# Altium schematic sheet Components.SchDoc
size 400 x 265 mm; SheetNumber: 2; SheetTotal: 2
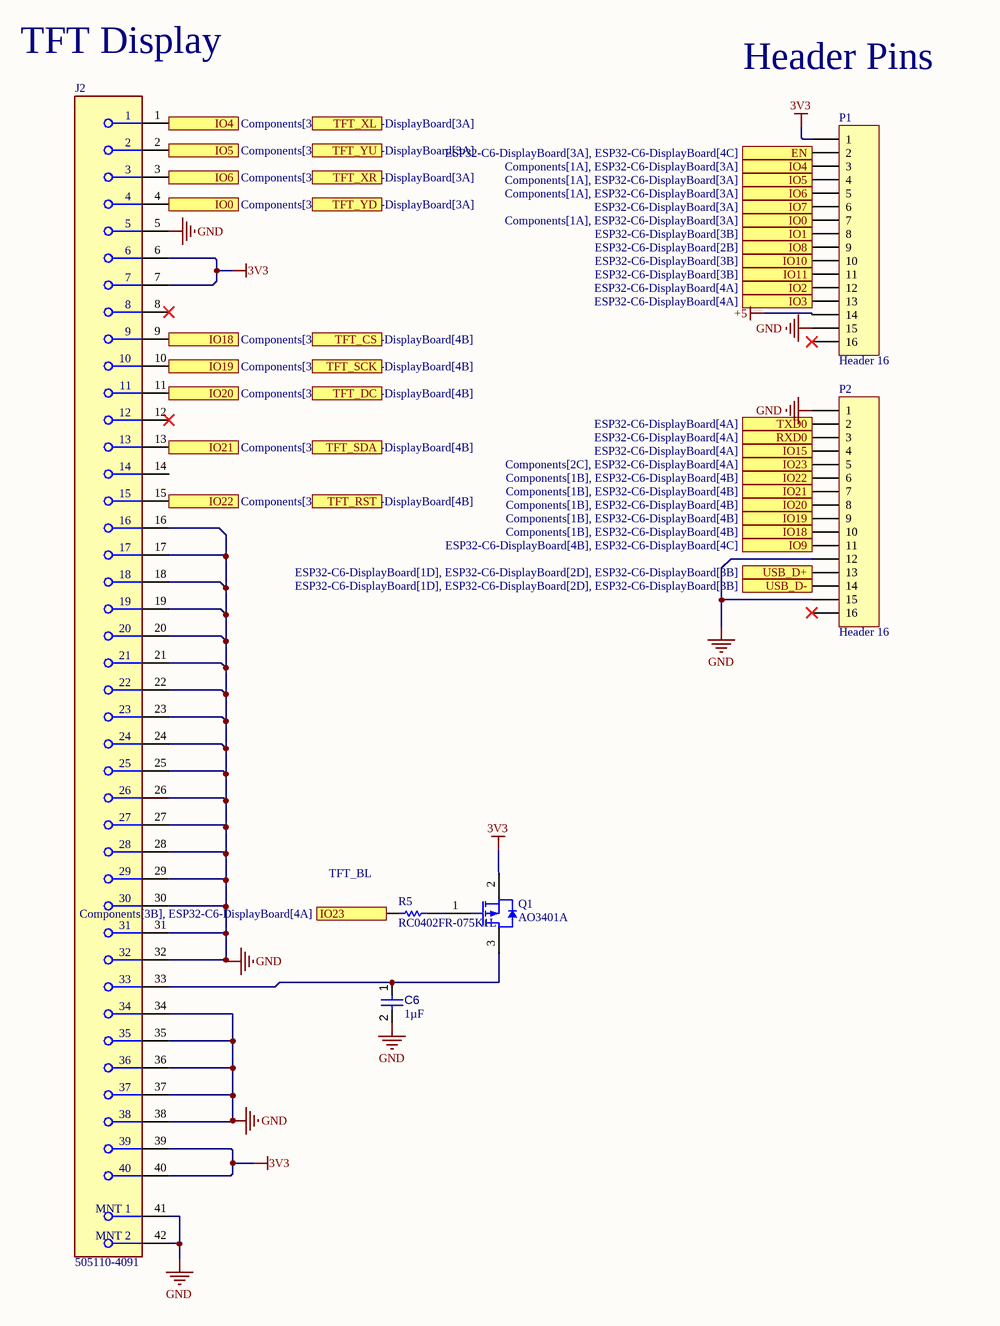
[diagram p0: Components.SchDoc]

## Parts
C6  value 1µF  [CAPC1005X55X25LL05T10]  (hidden comment: Capacitor 1 uF +/- 10% 6.3 V 0402)
J2  505110-4091  [FP-505110-4091-MFG]
P1  Header 16  [HDR1X16]
P2  Header 16  [HDR1X16]
Q1  AO3401A  [AO-SOT-23-3L_V]
R5  RC0402FR-075K1L  [RESC1005X40X25NL05T10]

## Ports
EN (see ESP32-C6-DisplayBoard[3A], ESP32-C6-DisplayBoard[4C]), IO0 (see Components[1A], ESP32-C6-DisplayBoard[3A]), IO0 (see Components[3A], ESP32-C6-DisplayBoard[3A]), IO1 (see ESP32-C6-DisplayBoard[3B]), IO2 (see ESP32-C6-DisplayBoard[4A]), IO3 (see ESP32-C6-DisplayBoard[4A]), IO4 (see Components[1A], ESP32-C6-DisplayBoard[3A]), IO4 (see Components[3A], ESP32-C6-DisplayBoard[3A]), IO5 (see Components[1A], ESP32-C6-DisplayBoard[3A]), IO5 (see Components[3A], ESP32-C6-DisplayBoard[3A]), IO6 (see Components[1A], ESP32-C6-DisplayBoard[3A]), IO6 (see Components[3A], ESP32-C6-DisplayBoard[3A]), IO7 (see ESP32-C6-DisplayBoard[3A]), IO8 (see ESP32-C6-DisplayBoard[2B]), IO9 (see ESP32-C6-DisplayBoard[4B], ESP32-C6-DisplayBoard[4C]), IO10 (see ESP32-C6-DisplayBoard[3B]), IO11 (see ESP32-C6-DisplayBoard[3B]), IO15 (see ESP32-C6-DisplayBoard[4A]), IO18 (see Components[1B], ESP32-C6-DisplayBoard[4B]), IO18 (see Components[3B], ESP32-C6-DisplayBoard[4B]), IO19 (see Components[1B], ESP32-C6-DisplayBoard[4B]), IO19 (see Components[3B], ESP32-C6-DisplayBoard[4B]), IO20 (see Components[1B], ESP32-C6-DisplayBoard[4B]), IO20 (see Components[3B], ESP32-C6-DisplayBoard[4B]), IO21 (see Components[1B], ESP32-C6-DisplayBoard[4B]), IO21 (see Components[3B], ESP32-C6-DisplayBoard[4B]), IO22 (see Components[1B], ESP32-C6-DisplayBoard[4B]), IO22 (see Components[3B], ESP32-C6-DisplayBoard[4B]), IO23 (see Components[2C], ESP32-C6-DisplayBoard[4A]), IO23 (see Components[3B], ESP32-C6-DisplayBoard[4A]), RXD0 (see ESP32-C6-DisplayBoard[4A]), TFT_CS, TFT_DC, TFT_RST, TFT_SCK, TFT_SDA, TFT_XL, TFT_XR, TFT_YD, TFT_YU, TXD0 (see ESP32-C6-DisplayBoard[4A]), USB_D+ (see ESP32-C6-DisplayBoard[1D], ESP32-C6-DisplayBoard[2D], ESP32-C6-DisplayBoard[3B]), USB_D- (see ESP32-C6-DisplayBoard[1D], ESP32-C6-DisplayBoard[2D], ESP32-C6-DisplayBoard[3B])

## Nets
3V3: J2.6 J2.7 J2.39 J2.40 P1.1 Q1.2(SOURCE)
+5: P1.14
GND: C6.2 J2.5 J2.16 J2.17 J2.18 J2.19 J2.20 J2.21 J2.22 J2.23 J2.24 J2.25 J2.26 J2.27 J2.28 J2.29 J2.30 J2.31 J2.32 J2.34 J2.35 J2.36 J2.37 J2.38 J2.41(MNT_1) J2.42(MNT_2) P1.15 P2.1 P2.12 P2.15
EN: P1.2 ; port EN
IO0: J2.4 P1.7 ; port IO0
IO1: P1.8 ; port IO1
IO2: P1.12 ; port IO2
IO3: P1.13 ; port IO3
IO4: J2.1 P1.3 ; port IO4
IO5: J2.2 P1.4 ; port IO5
IO6: J2.3 P1.5 ; port IO6
IO7: P1.6 ; port IO7
IO8: P1.9 ; port IO8
IO9: P2.11 ; port IO9
IO10: P1.10 ; port IO10
IO11: P1.11 ; port IO11
IO15: P2.4 ; port IO15
IO18: J2.9 P2.10 ; port IO18
IO19: J2.10 P2.9 ; port IO19
IO20: J2.11 P2.8 ; port IO20
IO21: J2.13 P2.7 ; port IO21
IO22: J2.15 P2.6 ; port IO22
IO23: P2.5 R5.2 ; port IO23
RXD0: P2.3 ; port RXD0
TXD0: P2.2 ; port TXD0
USB_D+: P2.13 ; port USB_D+
USB_D-: P2.14 ; port USB_D-
NetC6_1: C6.1 J2.33 Q1.3(DRAIN)
NetQ1_1: Q1.1(GATE) R5.1

Not connected (* = marked no-connect by the designer): J2 8* 12* 14; P1 16*; P2 16*

## Notes on the sheet
- TFT Display
- Header Pins
- (near R5) TFT_BL

## Library data of the parts
C6 = CMP-001-00008-6: Chip Capacitor, 1 uF, +/- 10%, 6.3 V, 0402 (1005 Metric); Capacitor Type: Ceramic; Voltage Rating: 6.3V; Max Operating Temperature: 85°C; Mounting Technology: SM; Tolerance: 10%; Case/Package: 0402; RoHS Compliant: True; Min Operating Temperature: -55°C; Pins: 2
J2 = CMP-04775-000011-1: CONN FFC/FPC BOTTOM 40P .5MM R/A; Actuator Material: Nylon; Mating Cycles: 25; Actuator Color: Black; Voltage Rating: 50V; Number of Circuits: 40; Current Rating: 500mA; Pitch: 0.5mm; Gender: Receptacle; Contact Plating: Gold; Number of Rows: 1; Number of Pins: 40; Termination: Solder; Packaging: Cut Tape; Max Operating Temperature: 105°C; Housing Color: Beige; Mount: Surface Mount; Halogen Free: Low Halogen; Flammability Rating: UL94 V-0; Series: Easy-On 505110; Min Operating Temperature: -40°C; Contact Material: Bronze; Housing Material: Polymer; Height: 1.9mm; Number of Contacts: 40; Number of Positions: 40; Orientation: Right Angle
P1 P2 = Header 16: Header, 16-Pin; LatestRevisionDate: 17-Jul-2002; LatestRevisionNote: Re-released for DXP Platform.; Publisher: Altium Limited
Q1 = CMP-2000-05778-1: P-Channel MOSFET, 30 V, 4 A, -55 to 150 degC, 3-Pin SOT-23-3L, RoHS, Tape and Reel; Manufacturer: Alpha and Omega; Output Power (Max): NotRequiredW; Power Dissipation: 1.4W; Rad Hardened: No; Drain Efficiency: NotRequired%; Drain-Source On-Volt: 30V; Noise Figure: NotRequireddB; Frequency (Max): NotRequiredMHz; Number of  Elements: 1; Gate-Source Voltage (Max): ?12V; Drain Current (Max): 4A; Channel Mode: Enhancement; Drain-Source On-Res: 0.044ohm; Type: PowerMOSFET; Polarity: P; Package URL: http://www.aosmd.com/res/packaging_information/SOT-23-3L.pdf; Datasheet URL: http://www.aosmd.com/res/data_sheets/AO3401A.pdf; Package Type: SOT-23; Package Description: 3-Pin Small Outline Transistor, Body 2.95 x 1.6 mm, Pitch 0.95 mm; Mounting: SurfaceMount; Manufacturer URL: http://www.aosmd.com/; Continuous Drain Current: 4A; Package Reference: SOT-23-3L; Mounting Technology: SurfaceMount; Operating Temperature Classification: Military; Power Gain: NotRequireddB; Datasheet Version: Rev. 3, 03/2011; Operating Temp Range: -55Cto150C; Pin Count: 3
R5 = CMP-2002-07753-1: Manufacturer: Yageo / Phycomp; Part Number: RC0402FR-075K1L